# EAGLE design USB_pinout (EAGLE 9.6.2)

## Sheet 1 of 2

## Sheet 2 of 2
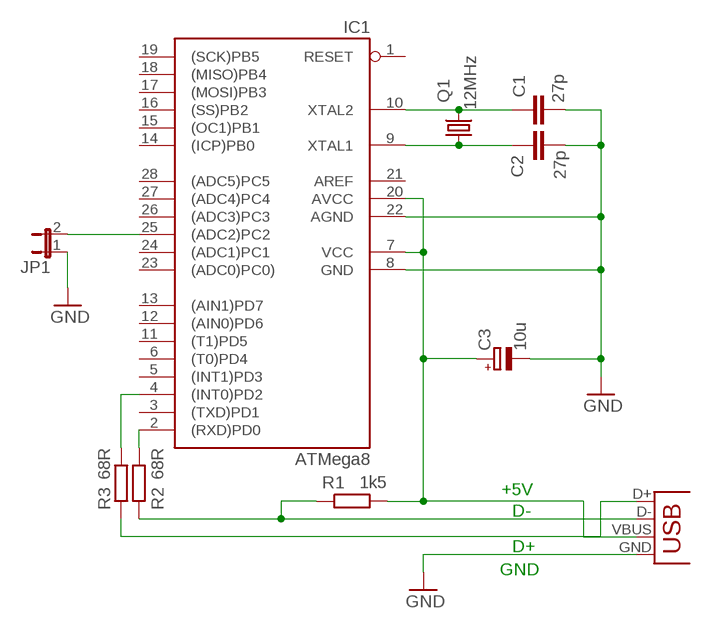
[diagram p0: schematic, sheet 2]

### Parts
C1  27p  C-EU025-024X044  [C025-024X044]
C2  27p  C-EU025-024X044  [C025-024X044]
C3  10u  CPOL-EUE2.5-5  [E2,5-5]
IC1  ATMega8  AT90S4433P  [DIL28-3]
JP1  JP1E  [JP1]
Q1  12MHz  CRYTALHC49S  [HC49/S]
R1  1k5  R-EU_0207/7  [0207/7]
R2  68R  R-EU_0207/7  [0207/7]
R3  68R  R-EU_0207/7  [0207/7]
X3  USB-B-H  [USB-B-H]

### Nets
D_N [diff pair]: R1.1 R2.1 X3.D-
D_P [diff pair]: R3.1 X3.D+
GND: C1.2 C2.2 C3.- IC1.8(GND) IC1.22(AGND) JP1.1 X3.GND
N$1: IC1.25((ADC2)PC2) JP1.2
N$20: IC1.4((INT0)PD2) R3.2
N$21: C1.1 IC1.10(XTAL2) Q1.2
N$22: C2.1 IC1.9(XTAL1) Q1.1
N$23: IC1.2((RXD)PD0) R2.2
VCC: C3.+ IC1.7(VCC) IC1.20(AVCC) R1.2 X3.VBUS
Unconnected: IC1.1(RESET) IC1.3((TXD)PD1) IC1.5((INT1)PD3) IC1.6((T0)PD4) IC1.11((T1)PD5) IC1.12((AIN0)PD6) IC1.13((AIN1)PD7) IC1.14((ICP)PB0) IC1.15((OC1)PB1) IC1.16((SS)PB2) IC1.17((MOSI)PB3) IC1.18((MISO)PB4) IC1.19((SCK)PB5) IC1.23((ADC0)PC0)) IC1.24((ADC1)PC1) IC1.26((ADC3)PC3) IC1.27((ADC4)PC4) IC1.28((ADC5)PC5)

### Notes on the sheet
- +5V
- D-
- D+
- GND

## Power pins joined to a net without a drawn wire
AREF: IC1.21(AREF)

## Library data of the parts
C1 C2 = rcl:C-EU: CAPACITOR, European symbol
C3 = rcl:CPOL-EU: POLARIZED CAPACITOR, European symbol
IC1 = atmel:AT90S4433: MICROCONTROLLER 4 Kbytes FLASH 128 bytes SRAM 256 bytes EEPROM UART 6-channel 10 bit ADC
JP1 = jumper:JP1E: JUMPER
Q1 = crystal:CRYTAL: CRYSTAL
R1-R3 = rcl:R-EU_: RESISTOR, European symbol
X3 = MIA_LIBRARY-2-2-2:USB: USB Connectors

## Net classes
1 diff pair: width 0.406 mm, clearance 0.406 mm

## Board
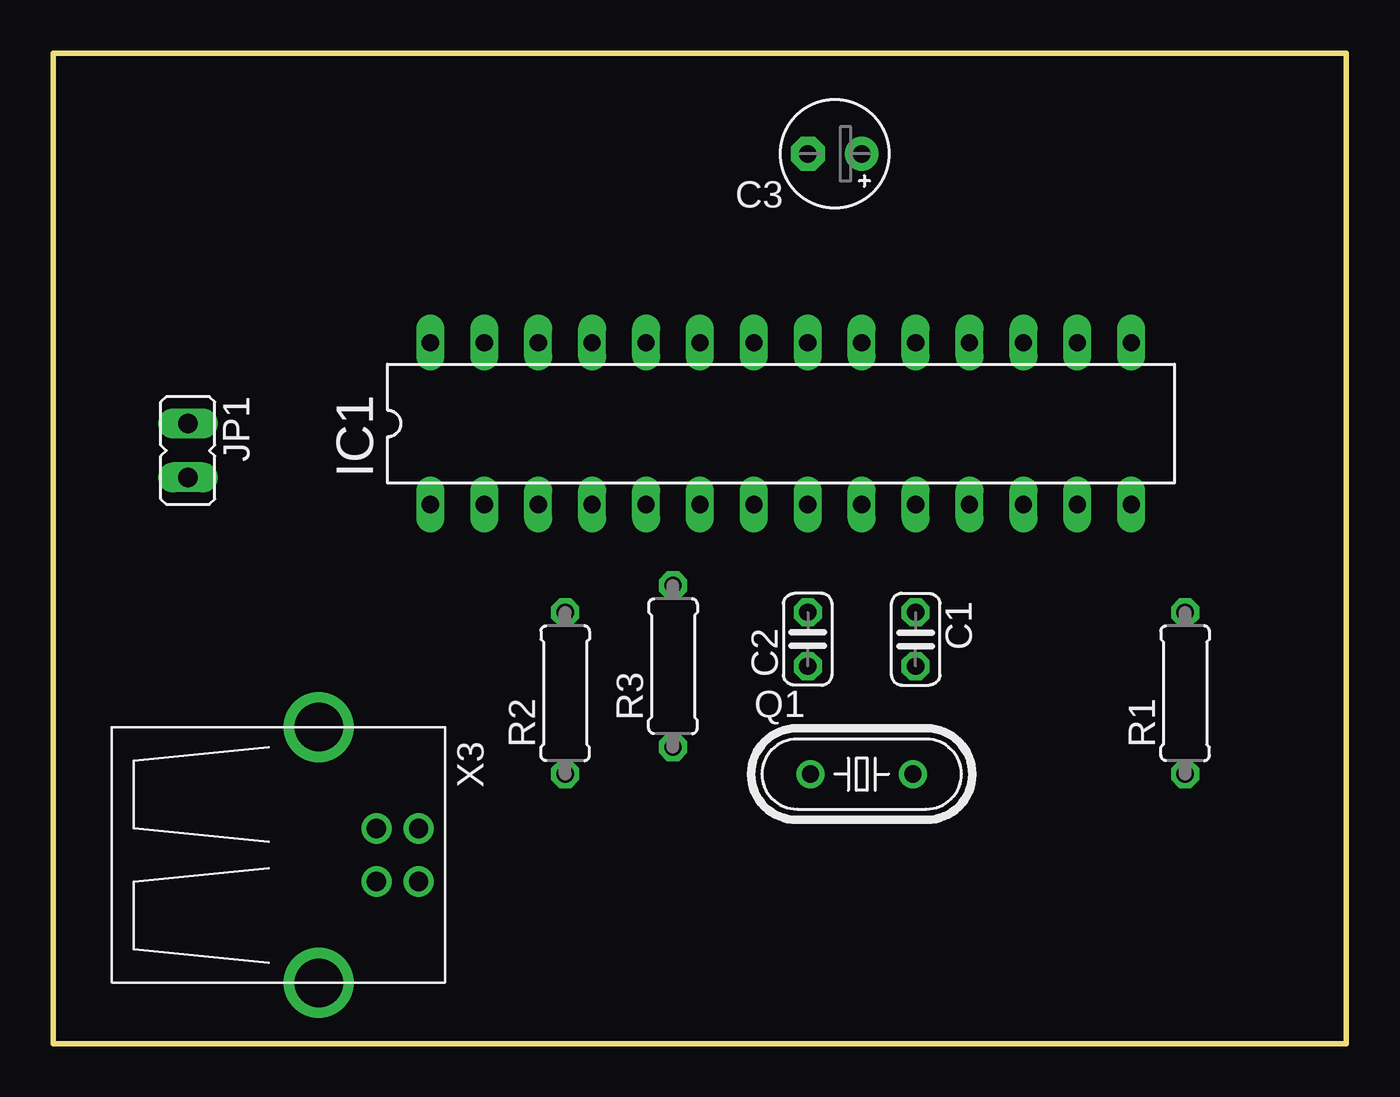
[diagram p1: board, top side]
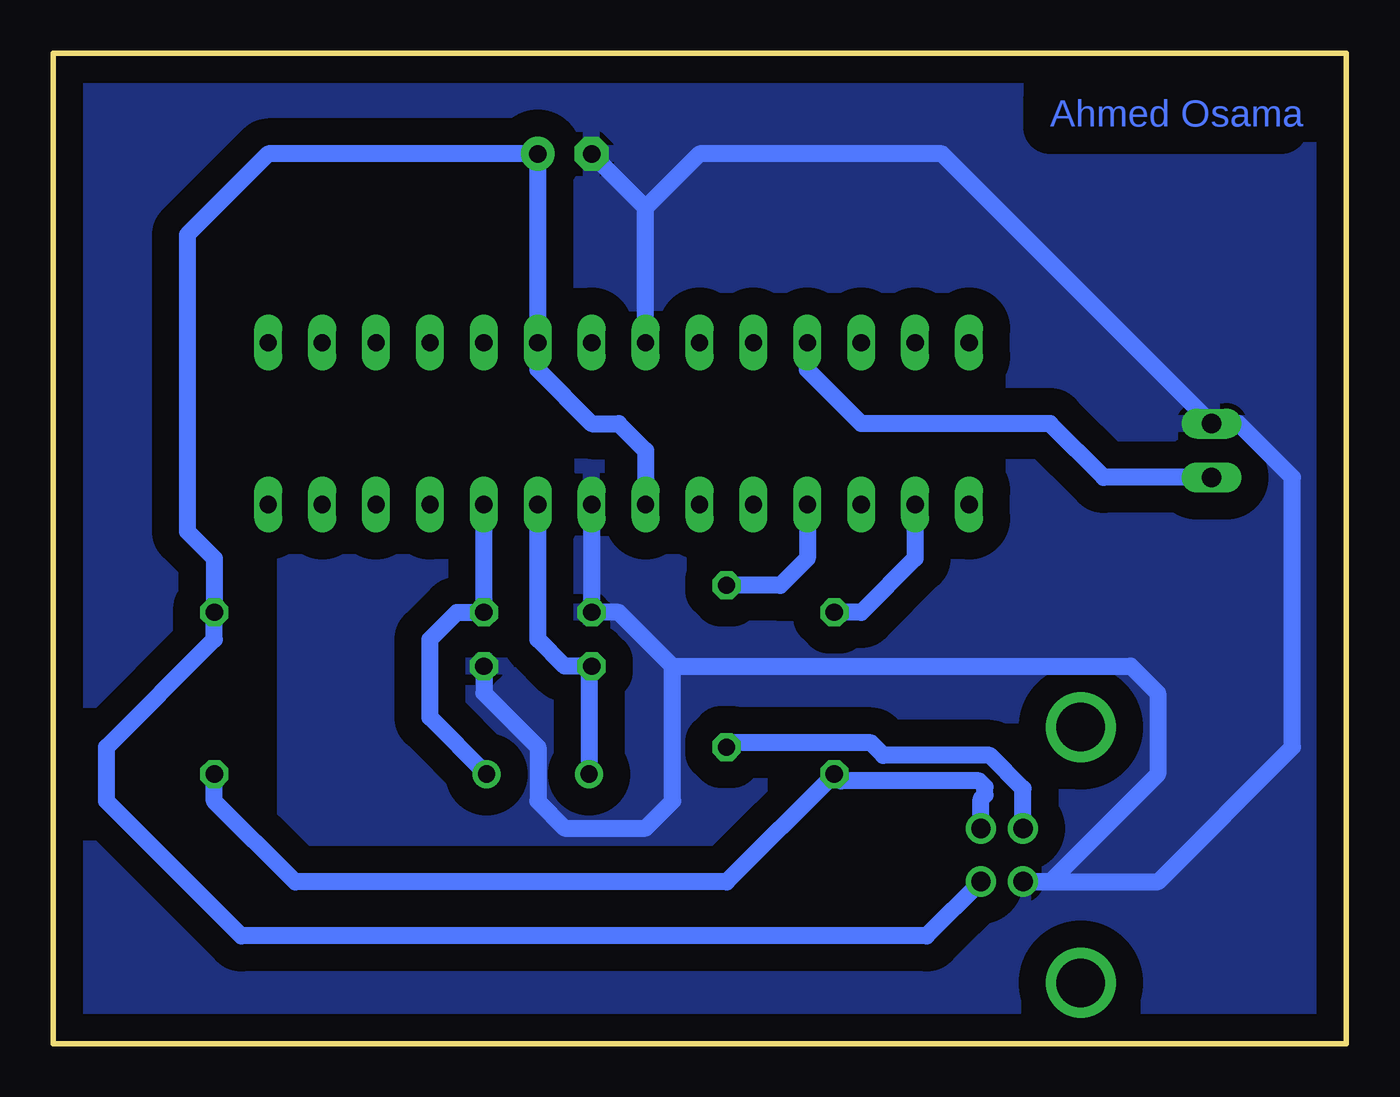
[diagram p2: board, bottom side, seen from below]

Size 60.94 x 46.66 mm. Coordinates in mm from the lower left corner, seen from the top.
Outline: 0,0 60.94,0 60.94,46.66 0,46.66 0,0
Copper layers (1*16): Top 0.035mm / dielectric 1.5mm / Bottom 0.035mm
Design rules "default": minimum track width 6mil, minimum drill 0.35mm, track to track 6mil, track to pad 6mil, pad to pad 6mil, via to via 6mil, smd to smd 6mil, copper to edge 40mil, drill to drill 6mil, minimum pad ring 10mil, minimum via ring 8mil, stop-mask expansion 4mil, vias tented up to drill 0mil, thermal gap 10mil

### Footprints (pad centres in the part's own frame; a part is rotated, then mirrored left to right if it is on the bottom)
C025-024X044 = drill 0.813 octagon: 1 -1.27,0; 2 1.27,0
E2,5-5 = drill 0.813 pad 1.6: + -1.27,0 | drill 0.813 pad 1.6 octagon: - 1.27,0
DIL28-3 = drill 0.813 long: 1 -16.51,-3.81; 2 -13.97,-3.81; 3 -11.43,-3.81; 4 -8.89,-3.81; 5 -6.35,-3.81; 6 -3.81,-3.81; 7 -1.27,-3.81; 8 1.27,-3.81; 9 3.81,-3.81; 10 6.35,-3.81; 11 8.89,-3.81; 12 11.43,-3.81; 13 13.97,-3.81; 14 16.51,-3.81; 15 16.51,3.81; 16 13.97,3.81; 17 11.43,3.81; 18 8.89,3.81; 19 6.35,3.81; 20 3.81,3.81; 21 1.27,3.81; 22 -1.27,3.81; 23 -3.81,3.81; 24 -6.35,3.81; 25 -8.89,3.81; 26 -11.43,3.81; 27 -13.97,3.81; 28 -16.51,3.81
JP1 = drill 0.914 long: 1 0,-1.27; 2 0,1.27
HC49/S = drill 0.813: 1 -2.413,0; 2 2.413,0
0207/7 = drill 0.813 octagon: 1 -3.81,0; 2 3.81,0
USB-B-H = drill 0.914: D+ 0,1.25; D- 1.981,1.25; GND 0,-1.25; VBUS 1.981,-1.25 | drill 2.286: P$1 -2.718,-6.02; P$2 -2.718,6.02

### Placement (x,y rotation side)
C1  40.64,19.05 270 top
C2  35.56,19.05 90 top
C3  36.83,41.91 180 top
IC1  34.29,29.21 0 top
JP1  6.35,27.94 180 top
Q1  38.1,12.7 0 top
R1  53.34,16.51 90 top
R2  24.13,16.51 90 top
R3  29.21,17.78 90 top
X3  15.24,8.89 0 top

### Tracks (layer width: path | path; a pad name or v marks a point on that pad's centre or on a via)
D_N  (via drill 0.35)
  Bottom 0.8: X3.D- 17.22,11.52 17.03,11.72 17.03,12.1 17.31,12.38 23.81,12.38 R2.1 29.21,7.62 49.53,7.62 53.34,11.43 R1.1
  other vias: 17.22,10.14
D_P  (via drill 0.35)
  Bottom 0.8: R3.1 29.01,14.17 22.4,14.17 21.82,13.59 16.81,13.59 15.24,12.02 X3.D+
  other vias: 15.24,10.14
GND
  Bottom 0.8: IC1.8 C2.2 34.29,20.32 31.75,17.78 | 33.02,39.37 C3.- | IC1.22 33.02,39.37 | 33.02,39.37 30.48,41.91 19.05,41.91 JP1.1 5.08,29.21 2.54,26.67 2.54,13.97 8.87,7.64 X3.GND 13.95,7.64 8.89,12.7 8.89,16.51 10.16,17.78 31.75,17.78 | C1.2 40.64,16.51 38.1,13.97 38.1,11.43 36.83,10.16 33.02,10.16 31.75,11.43 31.75,17.78
  pour Bottom (isolate 1.27): 0,0 0,46.99 60.96,46.99 60.96,0
  cutout Bottom (isolate 1.27): 25.4,33.02 25.4,25.4 33.02,25.4 33.02,33.02
  cutout Bottom (isolate 1.27): 50.8,22.86 50.8,11.43 52.07,10.16 54.61,10.16 55.88,10.16 58.42,12.7 58.42,15.24 54.61,19.05 54.61,22.86
N$1
  Bottom 0.8: IC1.25 25.4,31.75 22.86,29.21 13.97,29.21 11.43,26.67 JP1.2
N$20
  Bottom 0.8: IC1.4 25.4,22.86 26.67,21.59 R3.2
N$21
  Bottom 0.8: IC1.10 C1.1 41.91,20.32 43.18,19.05 43.18,15.37 Q1.2
N$22
  Bottom 0.8: Q1.1 35.69,17.65 C2.1 36.83,17.78 38.1,19.05 IC1.9
N$23
  Bottom 0.8: IC1.2 20.32,22.86 22.86,20.32 R2.2
VCC
  Bottom 0.8: IC1.7 33.02,27.94 34.29,29.21 35.56,29.21 38.1,31.75 IC1.20 C3.+ 50.8,41.91 54.61,38.1 54.61,24.13 53.34,22.86 R1.2 53.34,19.05 58.42,13.97 58.42,11.43 52.07,5.08 19.78,5.08 X3.VBUS

### Text on the board
Bottom: Ahmed Osama